# EAGLE schematic avr_7seg_charset (EAGLE 7.5.0)
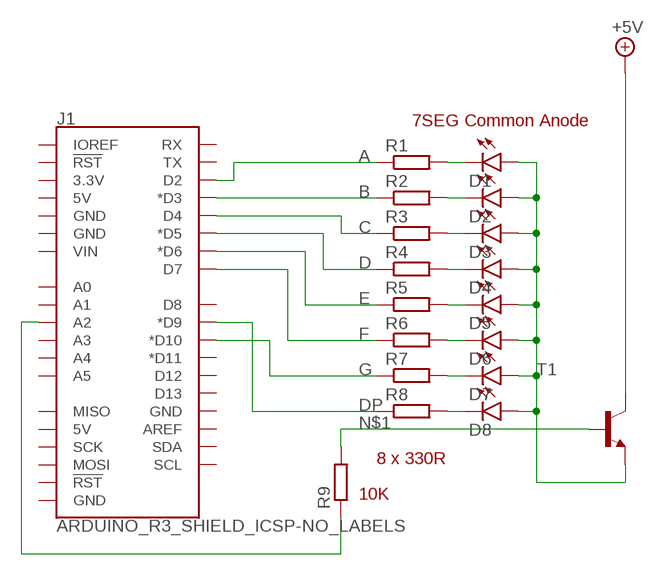
[diagram p0: schematic, sheet 1]

## Parts
D1  LED3MM  [LED3MM]
D2  LED3MM  [LED3MM]
D3  LED3MM  [LED3MM]
D4  LED3MM  [LED3MM]
D5  LED3MM  [LED3MM]
D6  LED3MM  [LED3MM]
D7  LED3MM  [LED3MM]
D8  LED3MM  [LED3MM]
J1  ARDUINO_R3_SHIELD_ICSP-NO_LABELS  [UNO_R3_SHIELD_ICSP_NOLABELS]
R1  R-EU_0207/7  [0207/7]
R2  R-EU_0207/7  [0207/7]
R3  R-EU_0207/7  [0207/7]
R4  R-EU_0207/7  [0207/7]
R5  R-EU_0207/7  [0207/7]
R6  R-EU_0207/7  [0207/7]
R7  R-EU_0207/7  [0207/7]
R8  R-EU_0207/7  [0207/7]
R9  R-EU_0207/7  [0207/7]
T1  -NPN-TO92-EBC  [TO92-EBC]

## Nets
+5V: T1.C
A: J1.D2 R1.1
B: J1.D3(*D3) R2.1
C: J1.D4 R3.1
D: J1.D5(*D5) R4.1
DP: J1.D9(*D9) R8.1
E: J1.D6(*D6) R5.1
F: J1.D7 R6.1
G: J1.D10(*D10) R7.1
N$1: R9.2 T1.B
N$2: D8.K(C) R8.2
N$3: D7.K(C) R7.2
N$4: D6.K(C) R6.2
N$5: D5.K(C) R5.2
N$6: D4.K(C) R4.2
N$7: D1.K(C) R1.2
N$8: D2.K(C) R2.2
N$9: D3.K(C) R3.2
N$10: D1.A D2.A D3.A D4.A D5.A D6.A D7.A D8.A T1.E
SEL: J1.A2 R9.1
Unconnected: J1.3.3V J1.5V J1.5V_ICSP(5V) J1.A0 J1.A1 J1.A3 J1.A4 J1.A5 J1.AREF J1.D8 J1.D11(*D11) J1.D12 J1.D13 J1.GND@0(GND) J1.GND@1(GND) J1.GND@2(GND) J1.GND_ICSP(GND) J1.IOREF J1.MISO J1.MOSI J1.RES(!RST!) J1.RST_ICSP(!RST!) J1.RX J1.SCK J1.SCL J1.SDA J1.TX J1.VIN

## Notes on the sheet
- 7SEG Common Anode
- 8 x 330R
- 10K

## Library data of the parts
D1-D8 = SparkFun-LED:LED: LEDs Standard schematic elements and footprints for 5mm, 3mm, 1206, and 0603 sized LEDs. 5mm - Spark Fun Electronics SKU : COM-00529 (and others); PROD_ID: DIO-08794
J1 = SparkFun-Boards:ARDUINO_R3_SHIELD_ICSP: Arduino R3 Shield Footprint w/ 6-pin (2x3) ICSP Header
R1-R9 = rcl:R-EU_: RESISTOR, European symbol
T1 = transistor:*-NPN-: NPN Transistror BF959 corrected 2008.03.06